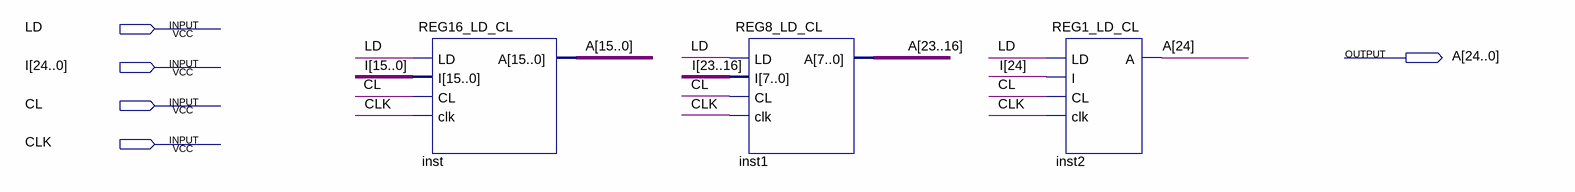
[diagram p0: schematic sheet]
// Quartus schematic REG25_LD_CL.bdf as structural Verilog: 3 symbols, 5 pins
module REG25_LD_CL (
  input  LD,
  input  [24:0] I,
  input  CL,
  input  CLK,
  output [24:0] A
);

  REG16_LD_CL inst (.LD(LD), .I(I[15:0]), .CL(CL), .clk(CLK), .A(A[15:0]));
  REG8_LD_CL inst1 (.LD(LD), .I(I[23:16]), .CL(CL), .clk(CLK), .A(A[23:16]));
  REG1_LD_CL inst2 (.LD(LD), .I(I[24]), .CL(CL), .clk(CLK), .A(A[24]));
endmodule
